# EAGLE design ADC (EAGLE 5.11)
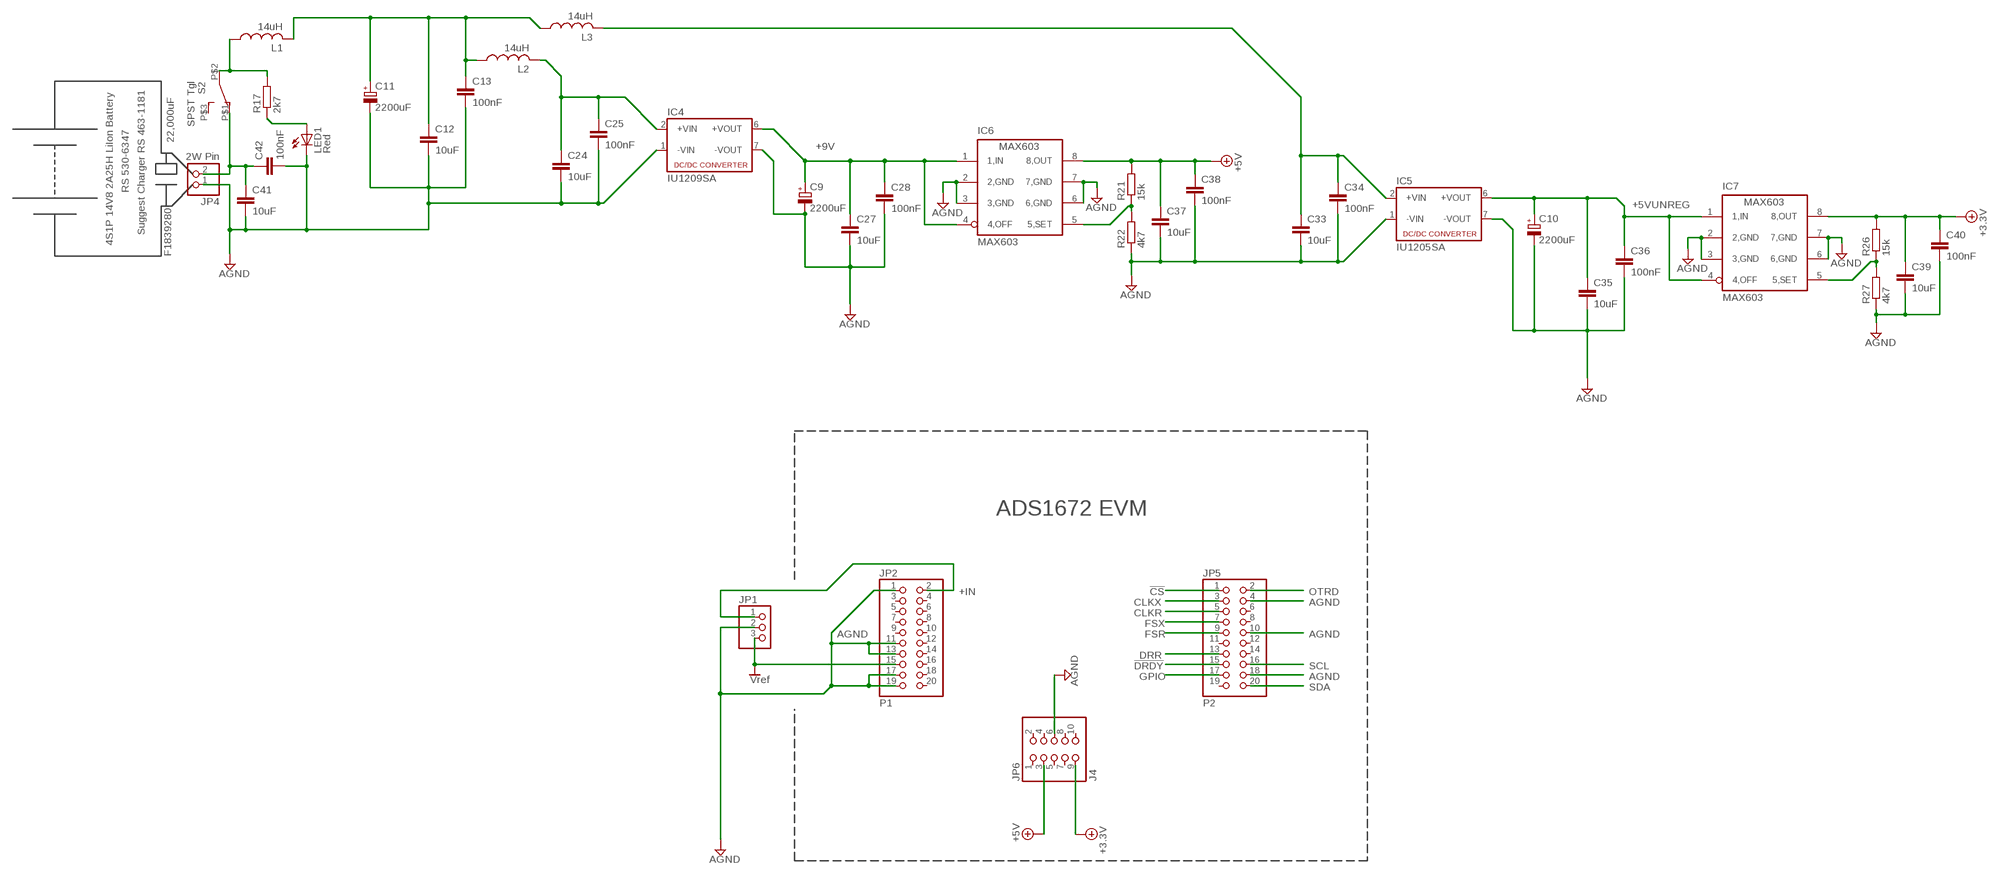
[diagram p0: schematic, sheet 1]

## Parts
C9  2200uF  CPOL-EUE35-16AXIAL  [E35-16]
C10  2200uF  CPOL-EUE35-16AXIAL  [E35-16]
C11  2200uF  CPOL-EUE35-16AXIAL  [E35-16]
C12  10uF  C-EUC1206  [C1206]
C13  100nF  C-EUC1206  [C1206]
C24  10uF  C-EUC1206  [C1206]
C25  100nF  C-EUC1206  [C1206]
C27  10uF  C-EUC1206  [C1206]
C28  100nF  C-EUC1206  [C1206]
C33  10uF  C-EUC1206  [C1206]
C34  100nF  C-EUC1206  [C1206]
C35  10uF  C-EUC1206  [C1206]
C36  100nF  C-EUC1206  [C1206]
C37  10uF  C-EUC1206  [C1206]
C38  100nF  C-EUC1206  [C1206]
C39  10uF  C-EUC1206  [C1206]
C40  100nF  C-EUC1206  [C1206]
C41  10uF  C-EUC1206  [C1206]
C42  100nF  C-EUC1206  [C1206]
IC4  IU1209SA  XP1/2WDC-DCSIL  [3+4SIL]
IC5  IU1205SA  XP1/2WDC-DCSIL  [3+4SIL]
IC6  MAX603  MAX603CSA  [SO08]
IC7  MAX603  MAX603CSA  [SO08]
JP1  PINHD-1X3  [1X03]
JP2  P1  PINHD-2X10  [2X10]
JP4  2W Pin  PINHD-1X2  [1X02]
JP5  P2  PINHD-2X10  [2X10]
JP6  J4  PINHD-2X5  [2X05]
L1  14uH  L-US0207/15  [0207/15]
L2  14uH  L-US0207/15  [0207/15]
L3  14uH  L-US0207/15  [0207/15]
LED1  Red  LED5MMR  [LED5MM]
R17  2k7  R-EU_0309/10  [0309/10]
R21  15k  R-EU_R0603  [R0603]
R22  4k7  R-EU_R0603  [R0603]
R26  15k  R-EU_R0603  [R0603]
R27  4k7  R-EU_R0603  [R0603]
S2  SPST Tgl  SPDTSTGL  [SPDTSTGL]

## Nets
!CS: JP5.1
!DRDY: JP5.15
+3.3V: C39.1 C40.1 IC7.8(8,OUT) JP6.9 R26.2
+5V: C37.1 C38.1 IC6.8(8,OUT) JP6.3 R21.2
+5VUNREG: C10.+ C35.1 C36.1 IC5.6(+VOUT) IC7.1(1,IN) IC7.4(4,OFF)
+9V: C9.+ C27.1 C28.1 IC4.6(+VOUT) IC6.1(1,IN) IC6.4(4,OFF)
+IN: JP1.1 JP2.2
AGND: C9.- C10.- C11.- C12.2 C13.2 C24.2 C25.2 C27.2 C28.2 C33.2 C34.2 C35.2 C36.2 C37.2 C38.2 C39.2 C40.2 C41.2 C42.2 IC4.1(-VIN) IC4.7(-VOUT) IC5.1(-VIN) IC5.7(-VOUT) IC6.2(2,GND) IC6.3(3,GND) IC6.6(6,GND) IC6.7(7,GND) IC7.2(2,GND) IC7.3(3,GND) IC7.6(6,GND) IC7.7(7,GND) JP1.2 JP2.1 JP2.11 JP2.13 JP2.17 JP2.19 JP4.1 JP5.4 JP5.10 JP5.18 JP6.6 LED1.K(C) R22.1 R27.1
CLKR: JP5.5
CLKX: JP5.3
DRR: JP5.13
FSR: JP5.9
FSX: JP5.7
GPIO: JP5.17
N$15: C41.1 C42.1 JP4.2 S2.P$1(O)
N$19: LED1.A R17.1
N$21: C24.1 C25.1 IC4.2(+VIN) L2.2
N$23: L1.1 R17.2 S2.P$2(P)
N$26: C11.+ C12.1 C13.1 L1.2 L2.1 L3.1
N$28: IC7.5(5,SET) R26.1 R27.2
N$31: C33.1 C34.1 IC5.2(+VIN) L3.2
N$32: IC6.5(5,SET) R21.1 R22.2
OTRD: JP5.2
SCL: JP5.16
SDA: JP5.20
VREF: JP1.3 JP2.15 ; supply symbol labelled Vref
Unconnected: JP2.3 JP2.4 JP2.5 JP2.6 JP2.7 JP2.8 JP2.9 JP2.10 JP2.12 JP2.14 JP2.16 JP2.18 JP2.20 JP5.6 JP5.8 JP5.11 JP5.12 JP5.14 JP5.19 JP6.1 JP6.2 JP6.4 JP6.5 JP6.7 JP6.8 JP6.10 S2.P$3(S)

## Notes on the sheet
- 22,000uF
- RS 530-6347
- Suggest Charger RS 463-1181
- 4S1P 14V8 2A25H LiIon Battery
- F1839280
- ADS1672 EVM

## Library data of the parts
C9-C11 = rcl:CPOL-EU: POLARIZED CAPACITOR, European symbol
C12 C13 C24 C25 C27 C28 C33-C42 = rcl:C-EU: CAPACITOR, European symbol
IC4 IC5 = dc-dc-converter:XP1/2WDC-DCSIL: XP Power 1(IW) or 2(IU) W SIL DC-DC, IziiooSA
IC6 IC7 = maxim:MAX603CSA: MAX603 adj V reg in SO8
JP1 = pinhead:PINHD-1X3: PIN HEADER
JP2 JP5 = pinhead:PINHD-2X10: PIN HEADER
JP4 = pinhead:PINHD-1X2: PIN HEADER
JP6 = pinhead:PINHD-2X5: PIN HEADER
L1-L3 = rcl:L-US: INDUCTOR, American symbol
LED1 = led:LED5MMR: Red 5mm LED
R17 = resistor:R-EU_: RESISTOR, European symbol
R21 R22 R26 R27 = rcl:R-EU_: RESISTOR, European symbol
S2 = switch:SPDTSTGL: Solder Tag SPDT Toggle Sw

## Board
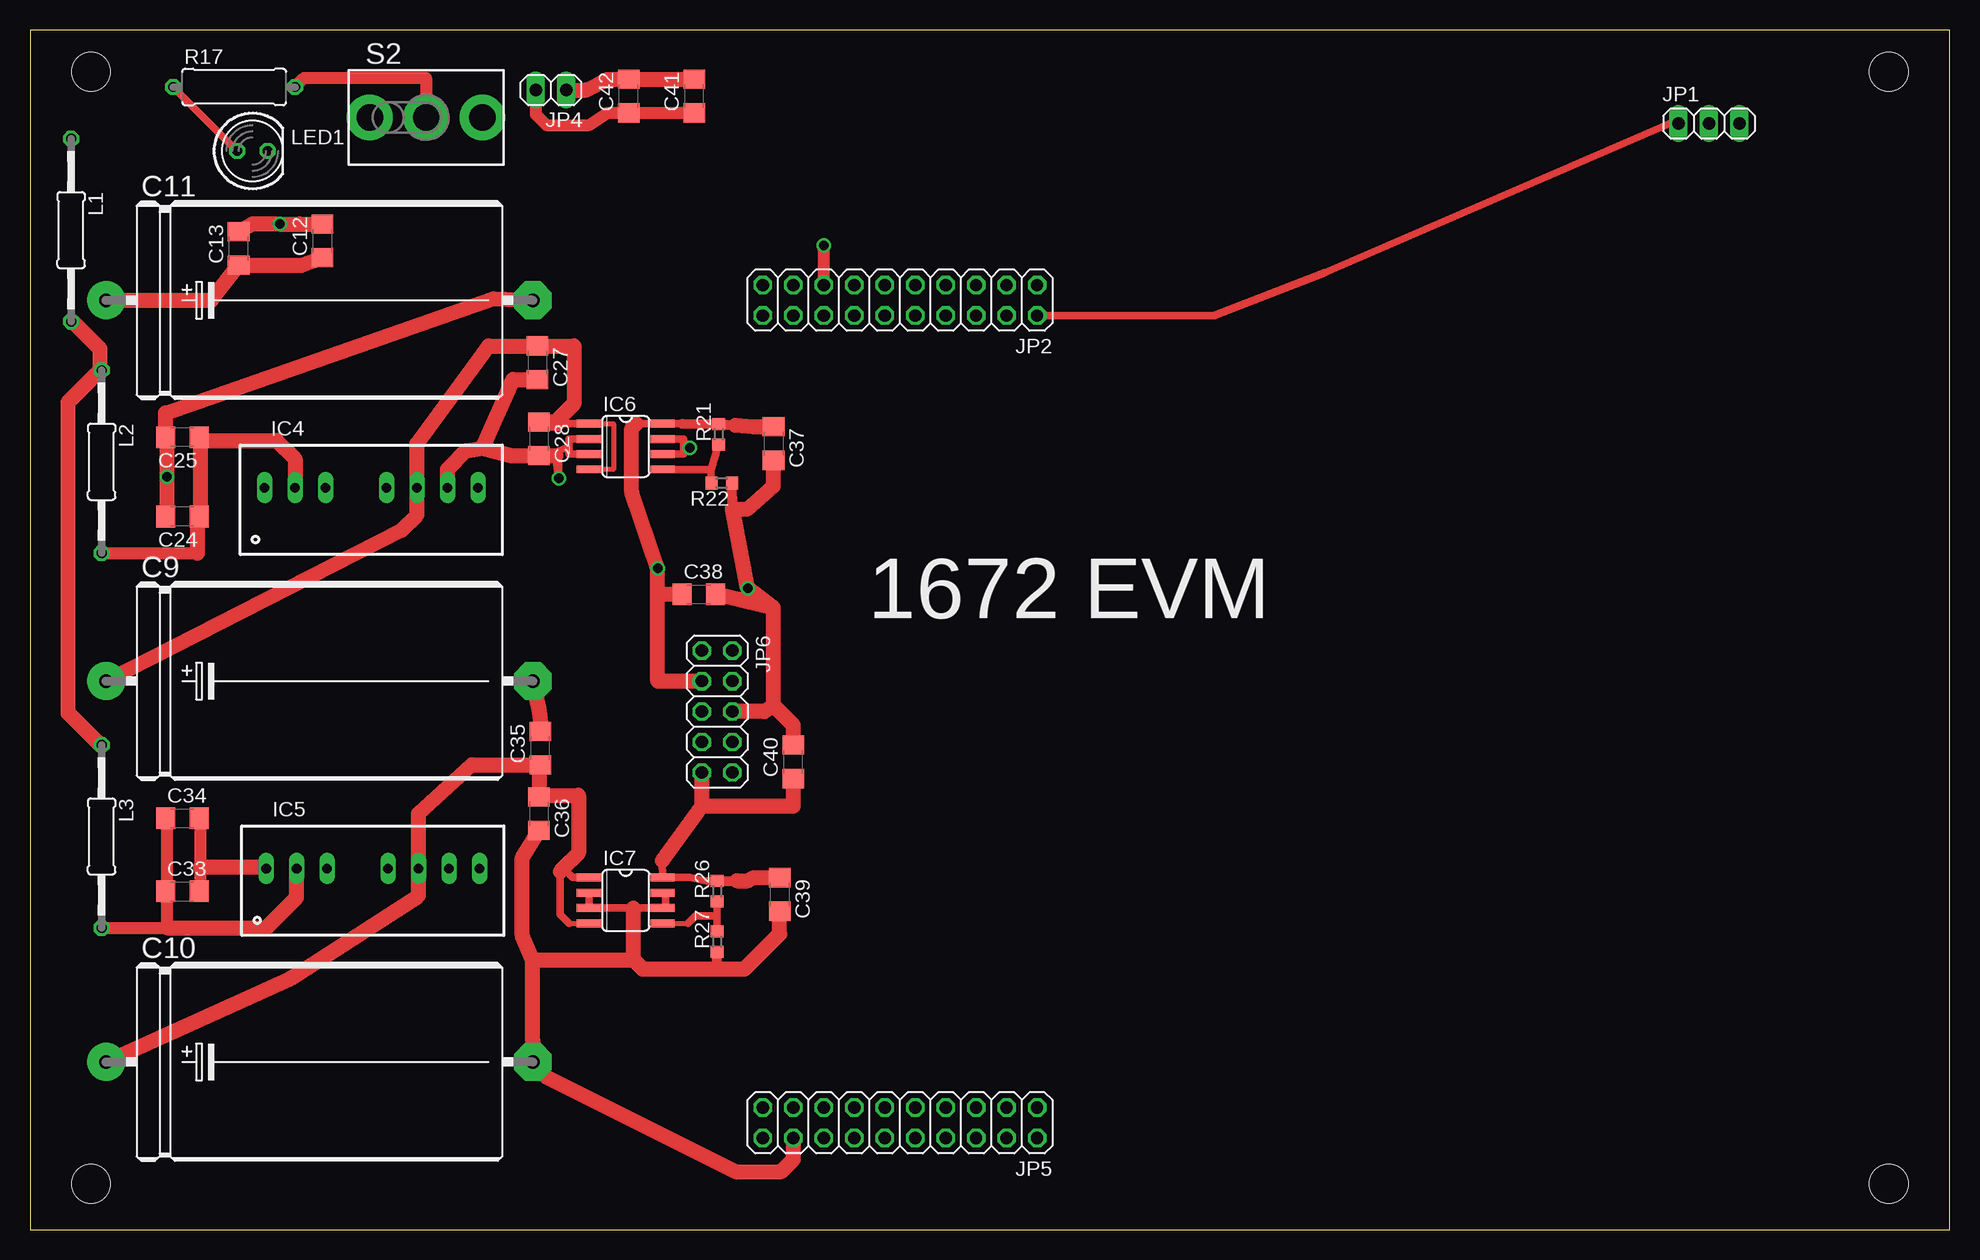
[diagram p1: board, top side]
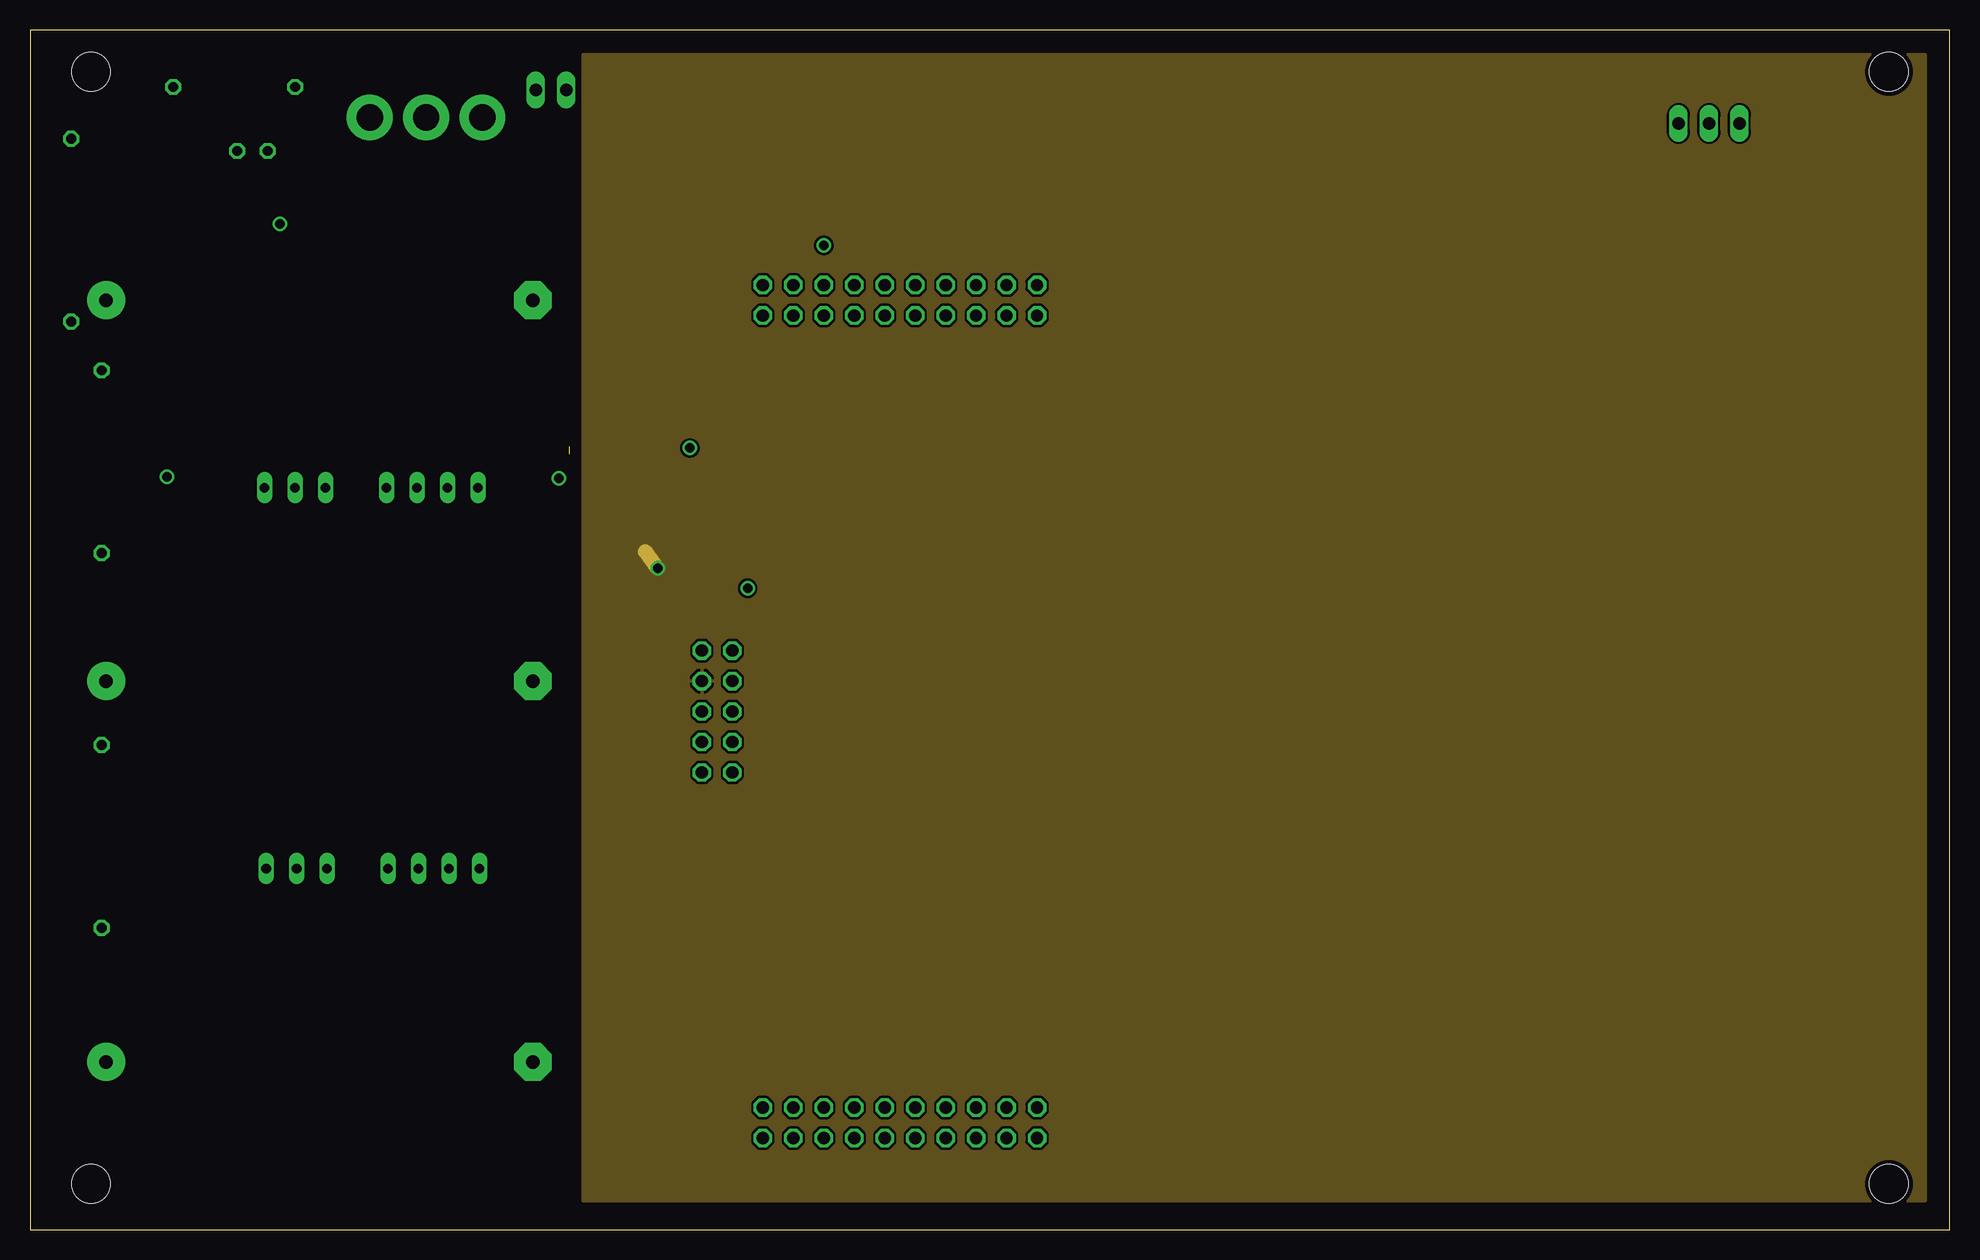
[diagram p2: board, inner layer Route2]
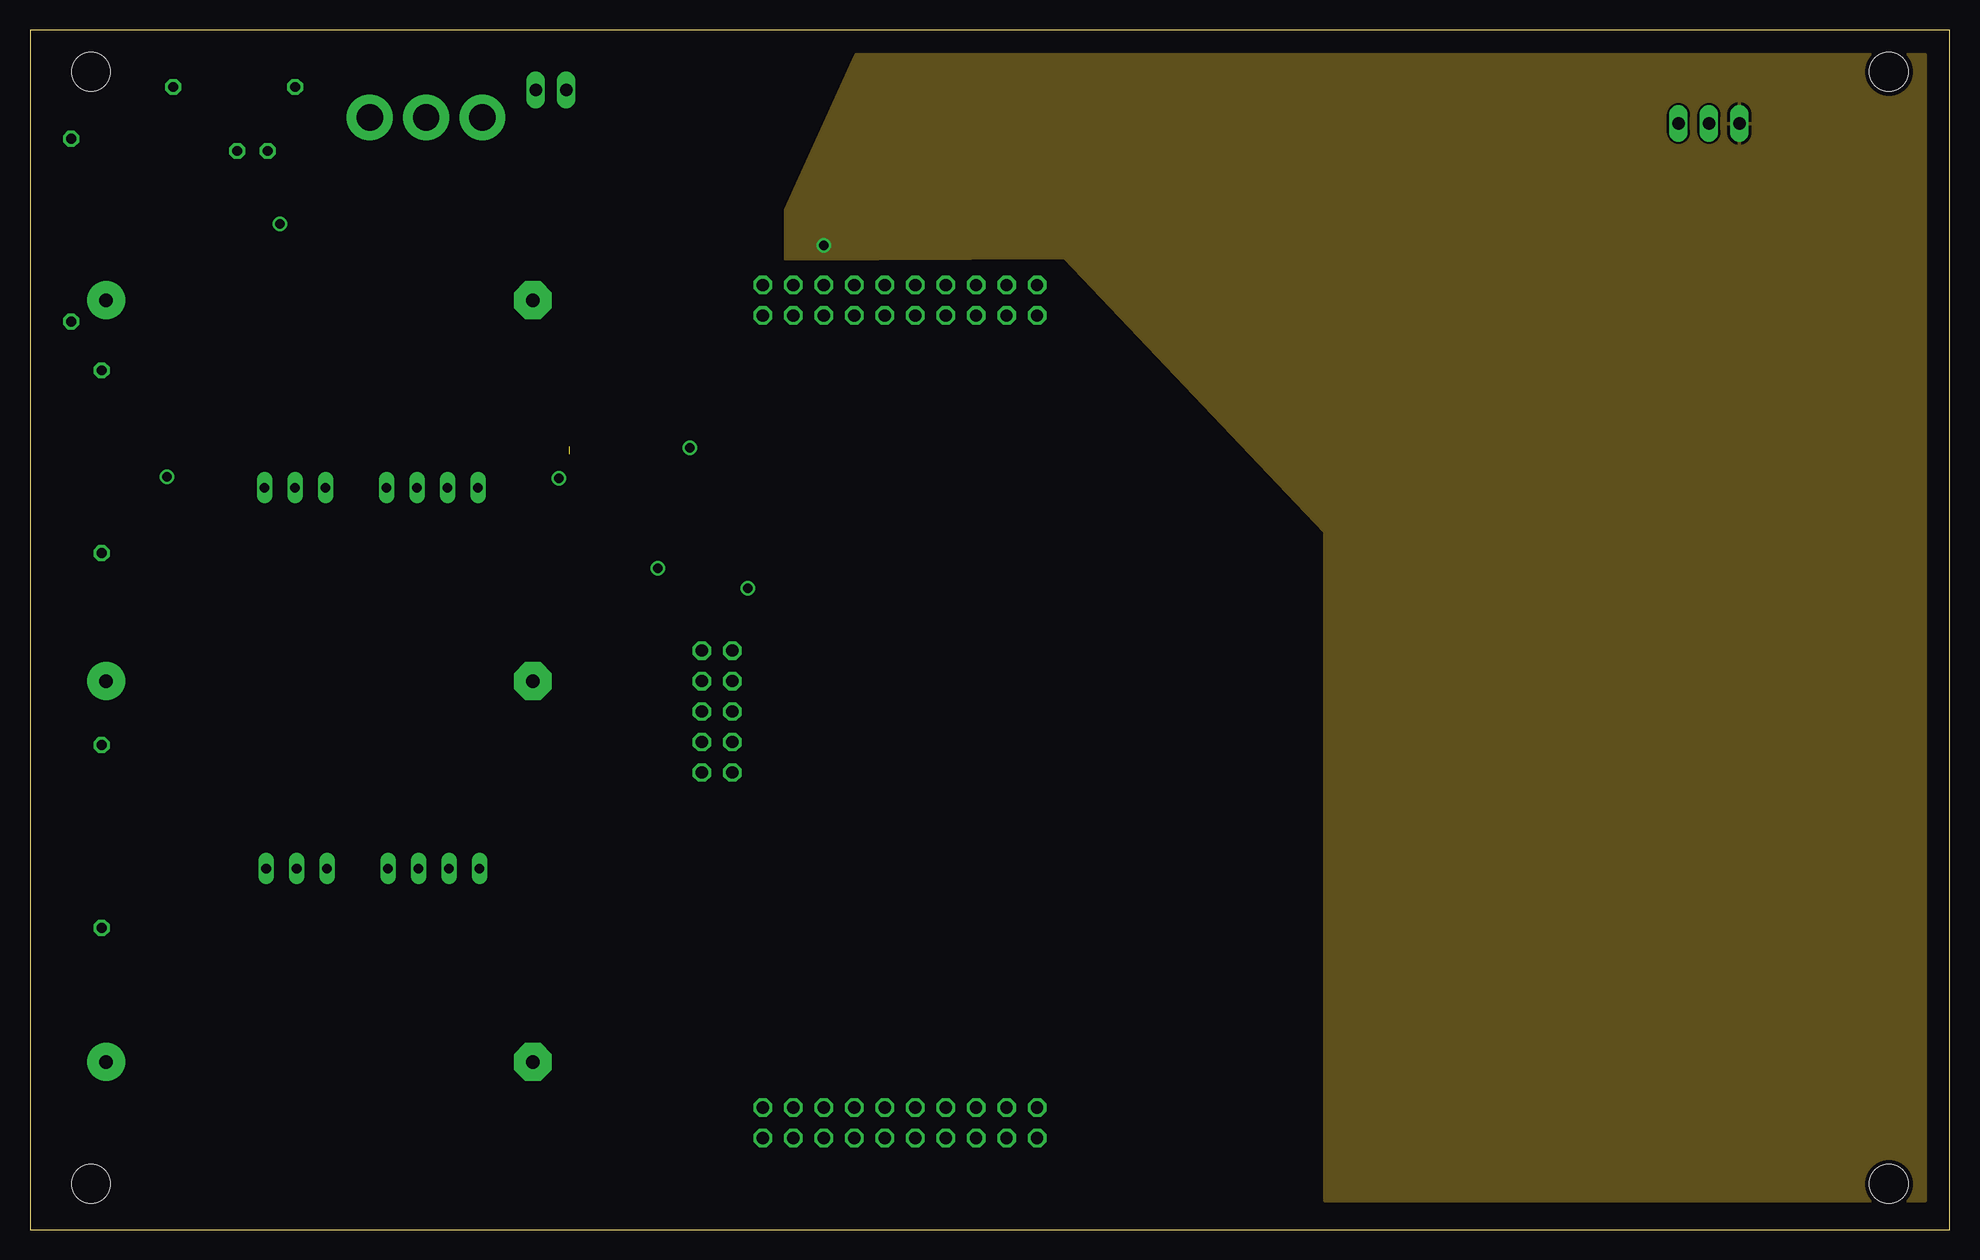
[diagram p3: board, inner layer Route15]
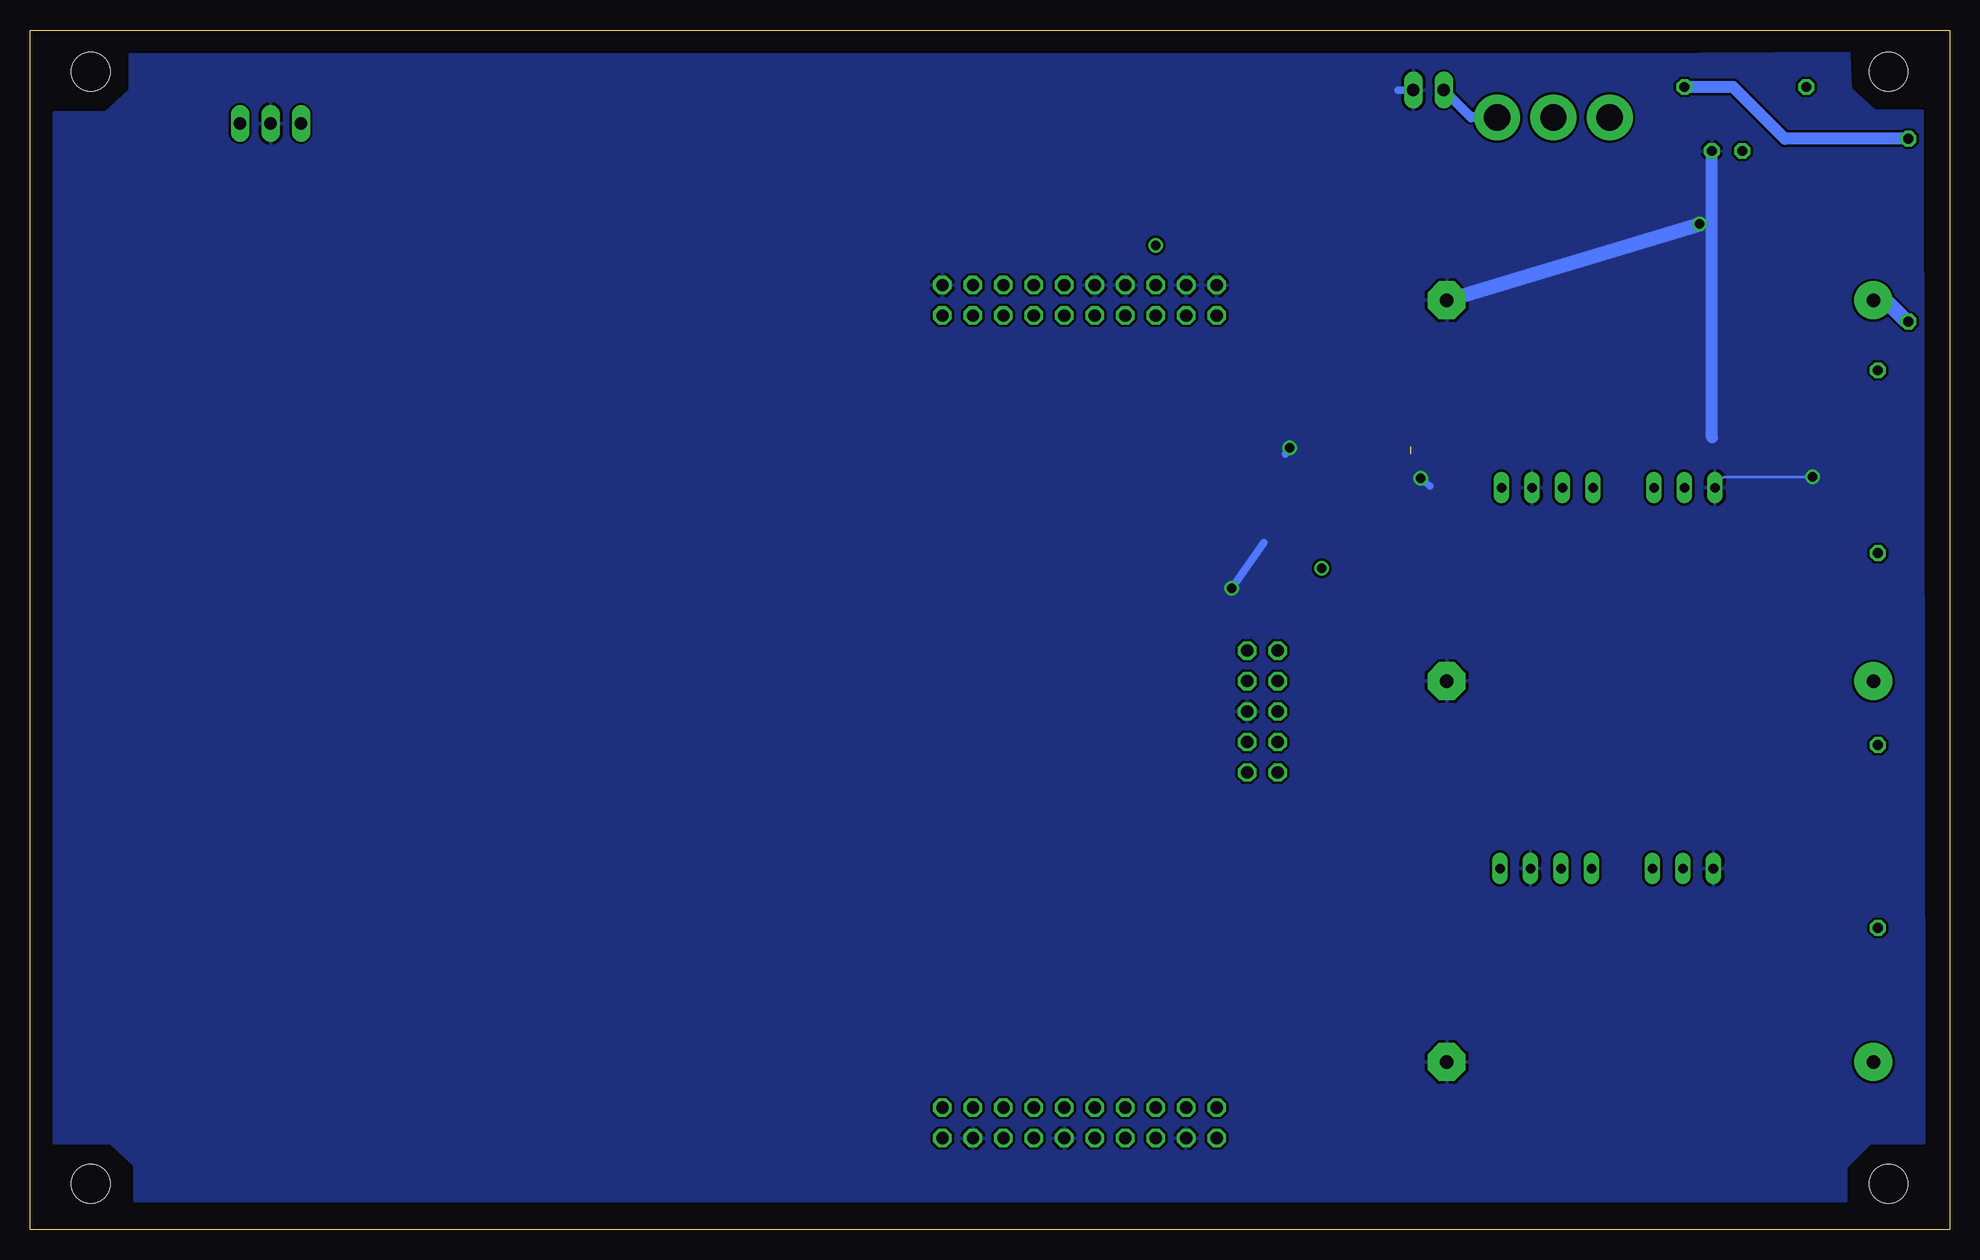
[diagram p4: board, bottom side, seen from below]

Size 160 x 100 mm. Coordinates in mm from the lower left corner, seen from the top.
Outline: 0,0 160,0 160,100 0,100 0,0
Copper layers (1+2*15+16): Top 0.018mm / dielectric 0.38mm / Route2 0.035mm / dielectric 0.71mm / Route15 0.035mm / dielectric 0.38mm / Bottom 0.018mm
Design rules "Tim": minimum track width 8mil, minimum drill 19mil, track to track 8mil, track to pad 7mil, pad to pad 7mil, via to via 8mil, smd to smd 7mil, copper to edge 15mil, drill to drill 8mil, minimum pad ring 10mil, minimum via ring 8mil, stop-mask expansion 4mil, vias tented up to drill 0mil, thermal gap 10mil
Holes 3.2 mm at 154.94,96.52 5.08,96.52 5.08,3.81 154.94,3.81

### Footprints (pad centres in the part's own frame; a part is rotated, then mirrored left to right if it is on the bottom)
E35-16 = drill 1.118 pad 3.15 round: + -17.78,0 | drill 1.118 pad 3.15 octagon: - 17.78,0
C1206 = smd 1.6 x 1.8: 1 -1.4,0; 2 1.4,0
3+4SIL = drill 0.8 long: 1 0,0; 2 2.54,0; 3 5.08,0; 5 10.16,0; 6 12.7,0; 7 15.24,0; 8 17.78,0
SO08 = smd 0.66 x 2.032: 1 -1.905,-3.073; 2 -0.635,-3.073; 3 0.635,-3.073; 4 1.905,-3.073; 5 1.905,3.073; 6 0.635,3.073; 7 -0.635,3.073; 8 -1.905,3.073
1X03 = drill 1.016 long: 1 -2.54,0; 2 0,0; 3 2.54,0
2X10 = drill 1.016 octagon: 1 -11.43,-1.27; 2 -11.43,1.27; 3 -8.89,-1.27; 4 -8.89,1.27; 5 -6.35,-1.27; 6 -6.35,1.27; 7 -3.81,-1.27; 8 -3.81,1.27; 9 -1.27,-1.27; 10 -1.27,1.27; 11 1.27,-1.27; 12 1.27,1.27; 13 3.81,-1.27; 14 3.81,1.27; 15 6.35,-1.27; 16 6.35,1.27; 17 8.89,-1.27; 18 8.89,1.27; 19 11.43,-1.27; 20 11.43,1.27
1X02 = drill 1.016 long: 1 -1.27,0; 2 1.27,0
2X05 = drill 1.016 octagon: 1 -5.08,-1.27; 2 -5.08,1.27; 3 -2.54,-1.27; 4 -2.54,1.27; 5 0,-1.27; 6 0,1.27; 7 2.54,-1.27; 8 2.54,1.27; 9 5.08,-1.27; 10 5.08,1.27
0207/15 = drill 0.813 octagon: 1 -7.62,0; 2 7.62,0
LED5MM = drill 0.813 octagon: A -1.27,0; K 1.27,0
0309/10 = drill 0.813 octagon: 1 -5.08,0; 2 5.08,0
R0603 = smd 1 x 1.1: 1 -0.85,0; 2 0.85,0
SPDTSTGL = drill 2.2 pad 3.81 round: P$1 4.699,0; P$2 0,0; P$3 -4.699,0

### Placement (x,y rotation side)
C9  24.13,45.72 0 top
C10  24.13,13.97 0 top
C11  24.13,77.47 0 top
C12  24.38,82.42 90 top
C13  17.4,81.79 90 top
C24  12.7,59.44 180 top
C25  12.7,66.04 180 top
C27  42.29,72.26 270 top
C28  42.42,65.91 270 top
C33  12.7,28.19 0 top
C34  12.7,34.29 0 top
C35  42.55,40.13 90 top
C36  42.42,34.67 270 top
C37  61.98,65.53 270 top
C38  55.75,52.96 0 top
C39  62.48,27.94 270 top
C40  63.63,38.99 90 top
C41  55.37,94.49 90 top
C42  49.91,94.49 90 top
IC4  19.56,61.85 0 top
IC5  19.68,30.1 0 top
IC6  49.66,65.28 270 top
IC7  49.66,27.43 270 top
JP1  139.95,92.2 0 top
JP2  72.52,77.47 180 top
JP4  43.43,95 180 top
JP5  72.52,8.89 180 top
JP6  57.28,43.18 270 top
L1  3.43,83.31 270 top
L2  5.97,64.01 270 top
L3  5.97,32.77 270 top
LED1  18.54,89.92 0 top
R17  17.02,95.25 0 top
R21  57.4,66.29 90 top
R22  57.66,62.23 180 top
R26  57.28,28.19 90 top
R27  57.28,24 90 top
S2  33.02,92.71 0 top

### Tracks (layer width: path | path; a pad name or v marks a point on that pad's centre or on a via)
+3.3V
  Top 0.203: 62.23,29.34 C39.1 | 57.66,29.08 R26.2 | C40.1
  Top 0.61: 57.66,29.08 56.39,29.08 54.99,29.34 IC7.8 52.7,30.73
  Top 0.813: 57.66,29.08 58.93,29.08
  Top 1.27: 58.93,29.08 59.82,29.08 60.33,29.34 62.23,29.34 | 52.7,30.73 56.01,35.31 | C40.1 63.63,35.31 56.01,35.31 | 56.01,35.31 JP6.9
+5V  (via drill 0.8)
  Top 0.61: 54.36,67.18 IC6.8 50.55,67.18
  Top 0.813: 54.36,67.18 R21.2 58.8,67.06
  Top 1.27: 58.8,67.06 60.33,66.93 C37.1 | 52.32,52.96 52.32,45.72 JP6.3 | 52.32,52.96 C38.1 | 50.55,67.18 50.16,66.8 50.16,61.47 v52.32,55.12 52.32,52.96
  Route2 1.27: v52.32,55.12 51.31,56.52
  pour Route2: 157.99,2.41 46.1,2.41 46.1,97.92 157.99,97.92
+5VUNREG
  Top 0.203: 42.8,38.73 C35.1 42.42,38.61 | 45.72,36.2 C36.1
  Top 0.406: 44.96,25.53 IC7.4
  Top 0.61: 44.45,30.1 45.21,29.34 IC7.1 | 44.96,25.53 44.2,26.29 44.2,29.84
  Top 1.27: 44.2,29.84 44.45,30.1 45.72,31.37 45.72,36.2 42.42,36.2 42.42,38.61 | 42.8,38.73 36.83,38.73 32.38,34.67 IC5.6 32.38,27.81 21.72,20.95 C10.+
+9V
  Top 0.203: 46.35,67.18 IC6.1 | 46.35,63.37 IC6.4 | C27.1 42.42,73.66
  Top 0.406: 46.35,67.18 48.64,67.18 48.64,63.37 46.35,63.37
  Top 0.61: 43.94,67.18 46.35,67.18
  Top 1.27: 43.94,67.18 C28.1 43.81,67.31 45.34,68.83 45.34,73.66 42.42,73.66 | C27.1 38.23,73.66 32.26,65.53 IC4.6 32.26,59.56 30.99,58.29 C9.+
+IN
  Top 0.203: 136.65,92.2 JP1.1
  Top 0.61: JP2.2 98.68,76.2 107.95,79.76 136.65,92.2
AGND  (via drill 0.8)  (1 unrouted)
  Top 0.203: 42.55,64.52 42.67,64.52 C28.2 42.8,64.52 | 46.61,27.94 IC7.2 | IC7.6 52.96,26.92 | 52.96,27.94 IC7.7 | 46.61,26.8 IC7.3 | C35.2 42.67,41.66 | 57.28,22.86 R27.1 | C33.2 14.22,27.94 | 14.22,34.29 C34.2 | 19.56,30.23 IC5.1 | 49.78,95.89 C42.2 | C24.2 11.43,59.69 | 11.43,66.04 C25.2
  Top 0.61: 43.05,12.7 C10.- 41.91,15.75 | IC6.2 44.96,65.91 44.96,64.64 IC6.3 | 54.48,65.15 54.48,65.91 IC6.7 | 46.61,27.94 46.61,26.8 50.29,26.8 IC7.6 | 52.96,26.92 52.96,27.94 | 43.81,64.52 v44.07,62.61 44.07,64.9 44.96,65.28 | IC6.6 54.48,64.64 54.48,65.15 | 54.48,65.15 v54.99,65.15
  Top 0.813: 58.55,60.07 R22.1 | 57.28,21.72 57.28,22.86
  Top 1.016: 14.22,27.94 14.22,30.23 14.22,34.29
  Top 1.27: 43.05,12.7 58.8,4.83 62.61,4.83 63.63,5.84 JP5.18 | 37.72,65.15 40.13,64.52 42.55,64.52 | 42.8,64.52 43.81,64.52 | C37.2 61.98,61.98 59.82,60.07 58.55,60.07 v59.82,53.47 61.98,51.82 | C39.2 62.48,24.64 59.56,21.72 57.28,21.72 51.05,21.72 50.29,22.48 | 42.67,41.66 42.42,43.43 C9.- | 41.91,22.48 41.02,24.51 41.02,30.99 C36.2 | 41.91,15.75 41.91,22.48 | 61.98,43.69 61.21,43.18 JP6.6 | 61.98,43.69 63.63,42.04 C40.2 | 61.98,43.69 61.98,51.82 | 41.91,22.48 50.29,22.48 | 50.29,22.48 50.29,26.8 | 61.98,51.82 C38.2 | 37.72,65.15 36.32,64.9 34.8,63.37 IC4.7 | 37.72,65.15 40.26,70.87 C27.2 | 14.22,30.23 19.56,30.23 | C41.2 55.12,95.89 49.78,95.89 48.13,95.89 46.35,95 JP4.1 | C12.2 22.48,83.82 v20.83,83.82 18.54,83.82 C13.2 | 11.43,66.04 v11.43,62.74 11.43,59.69 | C11.- 38.61,77.6 11.3,68.07 C25.2
  Bottom 0.203: v11.43,62.74 18.8,62.74 19.56,61.98 IC4.1
  Bottom 0.61: v44.07,62.61 43.31,61.98 | v59.82,53.47 57.15,57.28 | v54.99,65.15 55.37,64.64 | JP4.1 45.97,95
  Bottom 1.016: 19.81,66.04 LED1.K
  Bottom 1.27: C11.- v20.83,83.82
  pour Bottom: 157.99,7.24 153.29,7.24 151.26,5.33 151.26,2.41 8.64,2.41 8.64,5.21 6.6,7.24 2.16,7.24 2.16,12.57 2.29,93.22 6.22,93.22 8.26,95.12 8.38,98.04 27.05,97.92 151.64,97.92 151.64,95 153.67,93.09 157.99,93.09
N$15
  Top 0.203: C42.1 49.78,93.09
  Top 1.016: 49.78,93.09 55.12,93.09 C41.1 | JP4.2 42.16,92.96 43.05,92.08 46.61,92.08 48.13,93.09 C42.1
  Bottom 0.813: JP4.2 39.88,92.71 S2.P$1
N$19
  Top 0.61: LED1.A R17.1
N$21
  Top 0.203: 14.22,65.79 14.22,66.04 C25.1 | 14.22,59.69 C24.1 13.97,59.69
  Top 1.016: L2.2 13.97,56.39
  Top 1.27: 14.22,59.69 14.22,65.79 20.57,65.79 22.1,64.26 IC4.2 | 13.97,56.39 13.97,59.69
N$23
  Top 1.016: R17.2 22.86,96.01 33.02,96.01 S2.P$2
  Bottom 0.203: 13.72,90.93 13.97,91.19
  Bottom 1.016: 13.97,91.19 18.03,95.25 R17.2 | L1.1 13.72,90.93
N$26
  Top 0.203: L3.1 5.84,40.39 | 5.84,71.63 L2.1
  Top 1.016: 3.56,75.69 L1.2
  Top 1.27: C11.+ 15.11,77.47 C13.1 | C13.1 22.61,80.39 C12.1 | C13.1 | 5.84,40.39 3.17,43.05 3.17,68.96 5.84,71.63 5.84,73.41 3.56,75.69
  Bottom 0.203: L1.2 3.56,75.69
  Bottom 1.016: 5.33,77.47 C11.+
  Bottom 1.27: 3.56,75.69 5.33,77.47
N$28
  Top 0.406: IC7.5 54.86,25.53
  Top 0.61: 57.28,26.16 R26.1 | 57.28,26.16 R27.2 | 54.86,25.53 55.5,26.16 57.28,26.16
N$31
  Top 0.203: 11.43,34.29 C34.1 | 11.43,27.94 C33.1
  Top 1.016: 11.43,34.29 11.43,27.94 11.43,25.15 L3.2
  Top 1.27: 11.43,25.15 19.68,25.15 22.23,27.69 IC5.2
N$32
  Top 0.61: 56.77,63.37 R22.2 | 56.77,63.37 R21.1 | IC6.5 56.77,63.37
VREF  (via drill 0.8)
  Top 1.016: JP2.15 v66.17,82.04
  pour Route15: 157.99,2.41 107.95,2.41 107.95,58.17 86.23,81.03 62.99,80.9 62.99,84.96 68.83,97.92 157.99,97.92

### Text on the board
tPlace: 1672 EVM